# Altium project PCB_Project_MRIamp.PrjPCB (part 2 of 2)

## Sheet monitoring.SchDoc
size A3
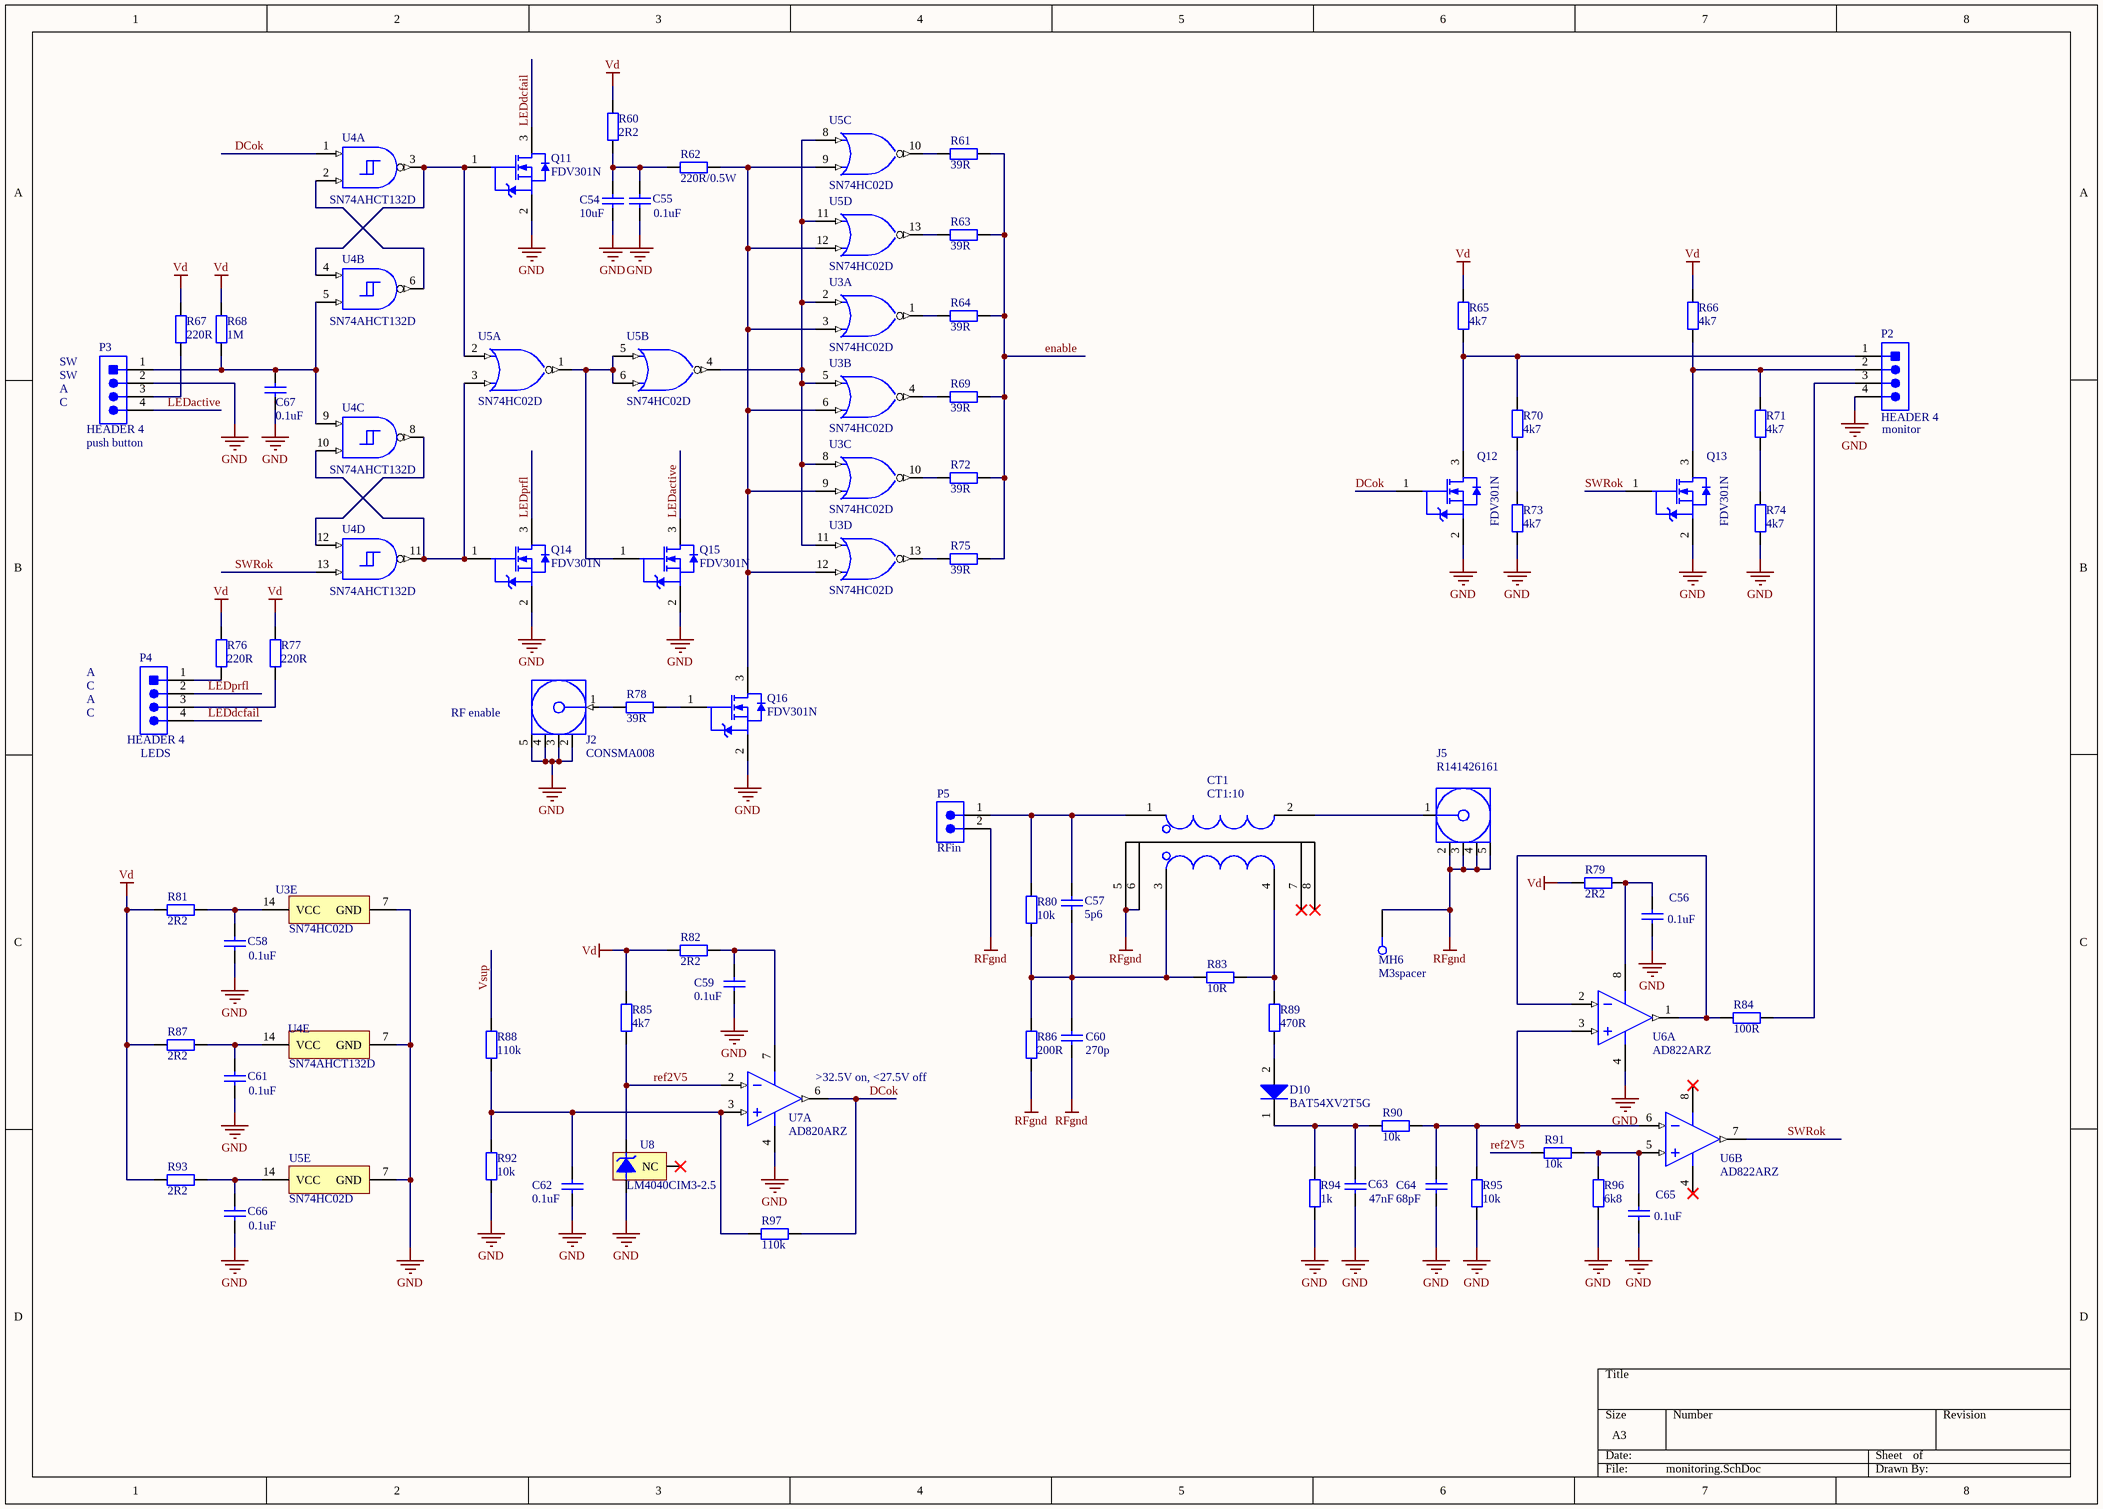
[diagram p1: monitoring.SchDoc]

### Parts
C54  value 10uF  [SM/C_1210]  (hidden comment: Cap)
C55  value 0.1uF  [SM/C_0805]  (hidden comment: Cap)
C56  value 0.1uF  [SM/C_0805]  (hidden comment: Cap)
C57  value 5p6  [SM/C_1206]  (hidden comment: Cap)
C58  value 0.1uF  [SM/C_0805]  (hidden comment: Cap)
C59  value 0.1uF  [SM/C_0805]  (hidden comment: Cap)
C60  value 270p  [SM/C_0805]  (hidden comment: Cap)
C61  value 0.1uF  [SM/C_0805]  (hidden comment: Cap)
C62  value 0.1uF  [SM/C_0805]  (hidden comment: Cap)
C63  value 47nF  [SM/C_0805]  (hidden comment: Cap)
C64  value 68pF  [SM/C_0805]  (hidden comment: Cap)
C65  value 0.1uF  [SM/C_0805]  (hidden comment: Cap)
C66  value 0.1uF  [SM/C_0805]  (hidden comment: Cap)
C67  value 0.1uF  [SM/C_0805]  (hidden comment: Cap)
CT1  CT1:10
D10  BAT54XV2T5G  [ONSC-SOD-523-2-502-01_V]
J2  CONSMA008  [SMA-Grotere-Gaten]
J5  R141426161  [BNC_Danny]
MH6  M3spacer  [MTHOLE3.2MM_TOPBOT7MM]  (no BOM)
P2  HEADER 4  [POLCON.100/VH/TM1SQS/W.300/4]
P3  HEADER 4  [POLCON.100/VH/TM1SQS/W.300/4]
P4  HEADER 4  [POLCON.100/VH/TM1SQS/W.300/4]
P5  RFin  [megaheader]
Q11  FDV301N  [FAIR-SOT23-3_V]
Q12  FDV301N  [FAIR-SOT23-3_V]
Q13  FDV301N  [FAIR-SOT23-3_V]
Q14  FDV301N  [FAIR-SOT23-3_V]
Q15  FDV301N  [FAIR-SOT23-3_V]
Q16  FDV301N  [FAIR-SOT23-3_V]
R60  value 2R2  [SM/R_0805]  (hidden comment: Res2)
R61  value 39R  [SM/R_0805]  (hidden comment: Res2)
R62  value 220R/0.5W  [SM/R_1210]  (hidden comment: Res2)
R63  value 39R  [SM/R_0805]  (hidden comment: Res2)
R64  value 39R  [SM/R_0805]  (hidden comment: Res2)
R65  value 4k7  [SM/R_0805]  (hidden comment: Res2)
R66  value 4k7  [SM/R_0805]  (hidden comment: Res2)
R67  value 220R  [SM/C_1206]  (hidden comment: Res2)
R68  value 1M  [SM/R_0805]  (hidden comment: Res2)
R69  value 39R  [SM/R_0805]  (hidden comment: Res2)
R70  value 4k7  [SM/R_0805]  (hidden comment: Res2)
R71  value 4k7  [SM/R_0805]  (hidden comment: Res2)
R72  value 39R  [SM/R_0805]  (hidden comment: Res2)
R73  value 4k7  [SM/R_0805]  (hidden comment: Res2)
R74  value 4k7  [SM/R_0805]  (hidden comment: Res2)
R75  value 39R  [SM/R_0805]  (hidden comment: Res2)
R76  value 220R  [SM/C_1206]  (hidden comment: Res2)
R77  value 220R  [SM/C_1206]  (hidden comment: Res2)
R78  value 39R  [SM/R_0805]  (hidden comment: Res2)
R79  value 2R2  [SM/R_0805]  (hidden comment: Res2)
R80  value 10k  [AX/.800X.200/.037]  (hidden comment: Res2)
R81  value 2R2  [SM/R_0805]  (hidden comment: Res2)
R82  value 2R2  [SM/R_0805]  (hidden comment: Res2)
R83  value 10R  [AX/.800X.200/.037]  (hidden comment: Res2)
R84  value 100R  [SM/C_1206]  (hidden comment: Res2)
R85  value 4k7  [SM/R_0805]  (hidden comment: Res2)
R86  value 200R  [AX/.550X.150/.034]  (hidden comment: Res2)
R87  value 2R2  [SM/R_0805]  (hidden comment: Res2)
R88  value 110k  [SM/R_0805]  (hidden comment: Res2)
R89  value 470R  [SM/R_0805]  (hidden comment: Res2)
R90  value 10k  [SM/R_0805]  (hidden comment: Res2)
R91  value 10k  [SM/R_0805]  (hidden comment: Res2)
R92  value 10k  [SM/R_0805]  (hidden comment: Res2)
R93  value 2R2  [SM/R_0805]  (hidden comment: Res2)
R94  value 1k  [SM/R_0805]  (hidden comment: Res2)
R95  value 10k  [SM/R_0805]  (hidden comment: Res2)
R96  value 6k8  [SM/R_0805]  (hidden comment: Res2)
R97  value 110k  [SM/R_0805]  (hidden comment: Res2)
U3  SN74HC02D  [D0014A_N]  (parts A,B,C,D,E of 5)
U4  SN74AHCT132D  [D0014A_L]  (parts A,B,C,D,E of 5)
U5  SN74HC02D  [D0014A_N]  (parts A,B,C,D,E of 5)
U6  AD822ARZ  [ADI-R-8_M]  (parts A,B of 2)
U7  AD820ARZ  [ADI-R-8_L]  (part A of 2)
U8  LM4040CIM3-2.5  [DBZ0003A_N]

### Nets
GND: C54.2 C55.1 C56.1 C58.1 C59.1 C61.1 C62.1 C63.1 C64.1 C65.1 C66.1 C67.1 J2.2(GND) J2.3(GND) J2.4(GND) J2.5(GND) P2.4 P3.2 Q11.2(S) Q12.2(S) Q13.2(S) Q14.2(S) Q15.2(S) Q16.2(S) R73.2 R74.2 R92.2 R94.2 R95.1 R96.1 U3.7(GND) U4.7(GND) U5.7(GND) U6.4(-V) U7.4(-VS) U8.2(-V)
RFgnd: C60.1 CT1.5 CT1.6 J5.2 J5.3 J5.4 J5.5 MH6.1(MH) P5.2 R86.2
Vd: R60.1 R65.1 R66.1 R67.1 R68.1 R76.1 R77.1 R79.1 R81.1 R82.1 R85.1 R87.1 R93.1
DCok: Q12.1(G) R97.2 U4.1(1A) U7.6(VOUT)
enable: R61.2 R63.2 R64.2 R69.2 R72.2 R75.2
LEDactive: P3.4 Q15.3(D)
LEDdcfail: P4.4 Q11.3(D)
LEDprfl: P4.2 Q14.3(D)
ref2V5: R85.2 R91.1 U7.2(-IN) U8.1(+V)
SWRok: Q13.1(G) U4.13(4B) U6.7(OUT_2)
Vsup: R88.1
NetC54_1: C54.1 C55.2 R60.2 R62.2
NetC56_2: C56.2 R79.2 U6.8(+V)
NetC57_1: C57.1 C60.2 CT1.3 R80.2 R83.2 R86.1
NetC57_2: C57.2 CT1.1 P5.1 R80.1
NetC58_2: C58.2 R81.2 U3.14(VCC)
NetC59_2: C59.2 R82.2 U7.7(+VS)
NetC61_2: C61.2 R87.2 U4.14(VCC)
NetC62_2: C62.2 R88.2 R92.1 R97.1 U7.3(+IN)
NetC63_2: C63.2 D10.1(K) R90.1 R94.1
NetC64_2: C64.2 R90.2 R95.2 U6.3(+IN_1) U6.6(-IN_2)
NetC65_2: C65.2 R91.2 R96.2 U6.5(+IN_2)
NetC66_2: C66.2 R93.2 U5.14(VCC)
NetC67_2: C67.2 P3.1 R68.2 U4.5(2B) U4.9(3A)
NetCT1_2: CT1.2 J5.1
NetCT1_4: CT1.4 R83.1 R89.1
NetD10_2: D10.2(A) R89.2
NetJ2_1: J2.1(Signal) R78.1
NetP2_1: P2.1 Q12.3(D) R65.2 R70.1
NetP2_2: P2.2 Q13.3(D) R66.2 R71.1
NetP2_3: P2.3 R84.1
NetP3_3: P3.3 R67.2
NetP4_1: P4.1 R76.2
NetP4_3: P4.3 R77.2
NetQ11_1: Q11.1(G) U4.3(1Y) U4.4(2A) U5.2(1A)
NetQ14_1: Q14.1(G) U4.10(3B) U4.11(4Y) U5.3(1B)
NetQ15_1: Q15.1(G) U5.1(1Y) U5.5(2A) U5.6(2B)
NetQ16_1: Q16.1(G) R78.2
NetQ16_3: Q16.3(D) R62.1 U3.3(1B) U3.6(2B) U3.9(3B) U3.12(4B) U5.9(3B) U5.12(4B)
NetR61_1: R61.1 U5.10(3Y)
NetR63_1: R63.1 U5.13(4Y)
NetR64_1: R64.1 U3.1(1Y)
NetR69_1: R69.1 U3.4(2Y)
NetR70_2: R70.2 R73.1
NetR71_2: R71.2 R74.1
NetR72_1: R72.1 U3.10(3Y)
NetR75_1: R75.1 U3.13(4Y)
NetR84_2: R84.2 U6.1(OUT_1) U6.2(-IN_1)
NetU3_2: U3.2(1A) U3.5(2A) U3.8(3A) U3.11(4A) U5.4(2Y) U5.8(3A) U5.11(4A)
NetU4_2: U4.2(1B) U4.6(2Y)
NetU4_8: U4.8(3Y) U4.12(4A)

Not connected (* = marked no-connect by the designer): CT1 7* 8*; U8 3(NC)*

### Notes on the sheet
- SW
- A
- C
- (near P3) push button
- (near P2) monitor
- (near J2) RF enable
- (near P4) LEDS
- (near U7) >32.5V on, <27.5V off

### Library data of the parts
C54 = Cap: Capacitor; FA: 1828840; Published: 8-Jun-2000; LatestRevisionDate: 17-Jul-2002; LatestRevisionNote: Re-released for DXP Platform.; PackageReference: RAD-0.3; Publisher: Altium Limited; PackageDescription: Radial Cap, Thru-Hole; 2 Leads; 0.3 in Pin Spacing
C55 C56 C58 C59 C61 C62 C65-C67 = Cap: Capacitor; FA: 2470440; Published: 8-Jun-2000; LatestRevisionDate: 17-Jul-2002; LatestRevisionNote: Re-released for DXP Platform.; PackageReference: RAD-0.3; Publisher: Altium Limited; PackageDescription: Radial Cap, Thru-Hole; 2 Leads; 0.3 in Pin Spacing
C57 = Cap: Capacitor; FA: 1301968; Published: 8-Jun-2000; LatestRevisionDate: 17-Jul-2002; LatestRevisionNote: Re-released for DXP Platform.; PackageReference: RAD-0.3; Publisher: Altium Limited; PackageDescription: Radial Cap, Thru-Hole; 2 Leads; 0.3 in Pin Spacing
C60 = Cap: Capacitor; FA: 2332698; Published: 8-Jun-2000; LatestRevisionDate: 17-Jul-2002; LatestRevisionNote: Re-released for DXP Platform.; PackageReference: RAD-0.3; Publisher: Altium Limited; PackageDescription: Radial Cap, Thru-Hole; 2 Leads; 0.3 in Pin Spacing
C63 = Cap: Capacitor; Published: 8-Jun-2000; LatestRevisionDate: 17-Jul-2002; LatestRevisionNote: Re-released for DXP Platform.; PackageReference: RAD-0.3; Publisher: Altium Limited; PackageDescription: Radial Cap, Thru-Hole; 2 Leads; 0.3 in Pin Spacing
C64 = Cap: Capacitor; FA: 1759274; Published: 8-Jun-2000; LatestRevisionDate: 17-Jul-2002; LatestRevisionNote: Re-released for DXP Platform.; PackageReference: RAD-0.3; Publisher: Altium Limited; PackageDescription: Radial Cap, Thru-Hole; 2 Leads; 0.3 in Pin Spacing
CT1 = Component_1
D10 = CMP-1055-00490-1: Schottky Barrier Diode, 2-Pin SOD-523, Pb-Free, Tape and Reel; Manufacturer: On Semiconductor; IFSM Max (A): 0.6; trr Max (ns): 5; Configuration: Single; FA: 2322476; PackageDescription: 2-Pin SOD, Body 1.2 x 0.8 mm; PackageReference: SOD-523-2-502-01; DatasheetVersion: Rev. 8; Packing: Tape and Reel; PackageVersion: Rev. E, 09/2010; ComponentLink2Description: Datasheet; ComponentLink3URL: http://www.onsemi.com/pub_link/Collateral/502-01.PDF; PartNumber: BAT54XV2T5G; RoHS: TRUE; ComponentLink2URL: http://www.onsemi.cn/pub_link/Collateral/BAT54XV2T1-D.PDF; ComponentLink1Description: Manufacturer URL; Mounting Technology: Surface Mount; ComponentLink3Description: Package Specification; ComponentLink1URL: http://www.onsemi.com/
J2 = CMP-0168-00003-1: SMA Female PCB Mount Connector - Extended; FA: 2112465; PackageDescription: SMA Female PCB Mount Connector, Extended, Thru-Hole, 7 x 7 mm Body; PackageReference: CON-SMA-L; DatasheetVersion: revB, Feb-2010; PackageVersion: revB, Feb-2010
J5 = CMP-2000-05627-1: Jack BNC Connector, 1 Position, Height 16.26 mm, Tail Length 6.35 mm, -55 to 85 degC, RoHS, Tube; Manufacturer: TE Connectivity; Frequency - Max: 4GHz; Dynamic Catalog: BNCConnectors; Connector Type: Jack,FemaleSockets; Other Names: A32269; Impedance: 50Ohm; 3D Model: 5227699-2.pdf; Contact Termination: Solder; FA: 4195115; Standard Package: 30; Mounting Technology: ThroughHole; Package Reference: 5227699-2; Category: Connectors,Interconnects; Datasheet URL: http://www.te.com/commerce/DocumentDelivery/DDEController?Action=showdoc&DocId=Customer+Drawing%7F5227699%7FA1%7Fpdf%7FEnglish%7FENG_CD_5227699_A1.pdf%7F5227699-2; Mounting Type: ThroughHole,Flange(Square); Datasheet Version: Rev. A1, 03/2011; Manufacturer URL: http://www.te.com/; RoHS Information: 5227699-2StatementofCompliance; Fastening Type: BayonetLock; Series: BNC; Connector Style: BNC; Family: CoaxialConnectors(RF); Packaging: Bulk; Package Description: Jack BNC Connector, 1 Position, Height 16.26 mm, Tail Length 6.35 mm
MH6 = CMP-0001-00114-1: Mounting Hole, Embedded System Module, 3.2mm pad, 2.7mm plated hole, Top / Bottom copper regions; ClassName: Mounting Hole; Publisher: Altium; Package Reference: Mounting-Hole-ESM
P2-P4 = CMP-1755-00007-1: Male Header, Pitch 2.5 mm, 1 x 4 Position, Height 6.1 mm, Tail Length 3.4 mm, -25 to 85 degC, RoHS, Bulk; FA: 588593; PackageReference: S4B-XH-A(LF)(SN); ComponentLink1Description: Manufacturer URL; DatasheetVersion: May-16; ComponentLink2Description: Datasheet; ComponentLink2URL: http://www.jst-mfg.com/product/pdf/eng/eXH.pdf; ComponentLink1URL: http://www.jst.com/home2.html; PackageDescription: Male Header, Pitch 2.5 mm, 1 x 4 Position, Height 6.1 mm, Tail Length 3.4 mm
P5 = CMP-0815-00001-1: Pin Header, Pitch 2.54 mm, 1 x 2 Positions, Straight, Mated Height 6.5 mm, Surface Mount, -40 to 105 degC, RoHS, Tape and Reel; Manufacturer: GCT; PartNumber: BG055-02-A-1-0650-0530-0350-L-B; Dielectric Withstanding: 600 V AC; Insulation Resistance: 1000 MOhm Min.; Current Rating: 3 A; Contact Resistance: 20 mOhm Max.; PackageReference: BG055-02-A-1-0650-0530-0350-2; PackageDescription: Pin Header, Pitch 2.54 mm, 1 x 2 Positions, Mated Height 6.5 mm; ComponentLink2URL: http://www.gct.co/pcb-board-to-board/pdf/BG055.pdf; Operating Temperature: -40 to 105 degC; ComponentLink2Description: Datasheet; RoHS: TRUE; ComponentLink1URL: http://www.gct.co/; Mounting Technology: Surface Mount; Orientation: Straight; ComponentLink1Description: Manufacturer URL; Packing: Tape and Reel; DatasheetVersion: Rev. G
Q11-Q16 = CMP-2000-04935-1: Digital FET, N-Channel, 0.35 W, 25 V, -55 to 150 degC, 3-Pin SOT23, RoHS, Tape and Reel; Manufacturer: Fairchild; Rds(on) Test Voltage Vgs: 2.7V; Threshold Voltage Vgs Typ: 850mV; Voltage Vds Typ: 25V; Transistor Case Style: SOT-23; Reel Quantity: 3000; Voltage Vgs Rds on Measurement: 4.5V; Power Dissipation Pd: 350mW; Continuous Drain Current Id: 220mA; Transistor Polarity: NChannel; No. of Transistors: 1; Package Version: Rev. 12, 03/2016; Voltage Vgs th Max: 1.5V; ESD HBM: 6kV; Pulse Current Idm: 500mA; Current Temperature: 25degC; On Resistance Rds(on): 5ohm; External Depth: 2.5mm; SMD Marking: 301; No. of Pins: 3; External Width: 3.05mm; SVHC: NoSVHC(19-Dec-2012); External Length / Height: 1.12mm; FA: 9845011; Termination Type: SMD; Package Reference: SOT23-3; Package URL: http://www.fairchildsemi.com/dwg/MA/MA03D.pdf; Voltage Vgs Max: 850mV; Drain Source Voltage Vds: 25V; Operating Temperature Max: 150degC; Package Description: 3-Pin Small Outline Transistor, Body 2.92 x 1.325 mm, Pitch 0.95 mm; Operating Temperature Min: -55degC; Datasheet Version: Jun-09; Tape Width: 8mm; Full Power Rating Temperature: 25degC; Datasheet URL: https://datasheet.ciiva.com/8114/fdv301n-8114688.pdf; Package / Case: SOT-23; Manufacturer URL: https://www.fairchildsemi.com/; Current Id Max: 220mA; Operating Temperature Range: -55degCto+150degC
R60 R79 R81 R82 R87 R93 = Res2: Resistor; FA: 2074326; Published: 8-Jun-2000; LatestRevisionDate: 17-Jul-2002; LatestRevisionNote: Re-released for DXP Platform.; PackageReference: AXIAL-0.4; Publisher: Altium Limited; PackageDescription: Axial Device, Thru-Hole; 2 Leads; 0.4 in Pin Spacing
R61 R63 R64 R69 R72 R75 R78 = Res2: Resistor; FA: 2074459; Published: 8-Jun-2000; LatestRevisionDate: 17-Jul-2002; LatestRevisionNote: Re-released for DXP Platform.; PackageReference: AXIAL-0.4; Publisher: Altium Limited; PackageDescription: Axial Device, Thru-Hole; 2 Leads; 0.4 in Pin Spacing
R62 = Res2: Resistor; FA: 2324036; Published: 8-Jun-2000; LatestRevisionDate: 17-Jul-2002; LatestRevisionNote: Re-released for DXP Platform.; PackageReference: AXIAL-0.4; Publisher: Altium Limited; PackageDescription: Axial Device, Thru-Hole; 2 Leads; 0.4 in Pin Spacing
R65 R66 R70 R71 R73 R74 R85 = Res2: Resistor; FA: 2447672; Published: 8-Jun-2000; LatestRevisionDate: 17-Jul-2002; LatestRevisionNote: Re-released for DXP Platform.; PackageReference: AXIAL-0.4; Publisher: Altium Limited; PackageDescription: Axial Device, Thru-Hole; 2 Leads; 0.4 in Pin Spacing
R67 R76 R77 = Res2: Resistor; FA: 2447486; Published: 8-Jun-2000; LatestRevisionDate: 17-Jul-2002; LatestRevisionNote: Re-released for DXP Platform.; PackageReference: AXIAL-0.4; Publisher: Altium Limited; PackageDescription: Axial Device, Thru-Hole; 2 Leads; 0.4 in Pin Spacing
R68 = Res2: Resistor; FA: 2447596; Published: 8-Jun-2000; LatestRevisionDate: 17-Jul-2002; LatestRevisionNote: Re-released for DXP Platform.; PackageReference: AXIAL-0.4; Publisher: Altium Limited; PackageDescription: Axial Device, Thru-Hole; 2 Leads; 0.4 in Pin Spacing
R80 = Res2: Resistor; FA: 1738702; Published: 8-Jun-2000; LatestRevisionDate: 17-Jul-2002; LatestRevisionNote: Re-released for DXP Platform.; PackageReference: AXIAL-0.4; Publisher: Altium Limited; PackageDescription: Axial Device, Thru-Hole; 2 Leads; 0.4 in Pin Spacing
R83 = Res2: Resistor; FA: 1357898; Published: 8-Jun-2000; LatestRevisionDate: 17-Jul-2002; LatestRevisionNote: Re-released for DXP Platform.; PackageReference: AXIAL-0.4; Publisher: Altium Limited; PackageDescription: Axial Device, Thru-Hole; 2 Leads; 0.4 in Pin Spacing
R84 = Res2: Resistor; FA: 2447454; Published: 8-Jun-2000; LatestRevisionDate: 17-Jul-2002; LatestRevisionNote: Re-released for DXP Platform.; PackageReference: AXIAL-0.4; Publisher: Altium Limited; PackageDescription: Axial Device, Thru-Hole; 2 Leads; 0.4 in Pin Spacing
R86 = Res2: Resistor; FA: 9340149; Published: 8-Jun-2000; LatestRevisionDate: 17-Jul-2002; LatestRevisionNote: Re-released for DXP Platform.; PackageReference: AXIAL-0.4; Publisher: Altium Limited; PackageDescription: Axial Device, Thru-Hole; 2 Leads; 0.4 in Pin Spacing
R88 R97 = Res2: Resistor; FA: 2447557; Published: 8-Jun-2000; LatestRevisionDate: 17-Jul-2002; LatestRevisionNote: Re-released for DXP Platform.; PackageReference: AXIAL-0.4; Publisher: Altium Limited; PackageDescription: Axial Device, Thru-Hole; 2 Leads; 0.4 in Pin Spacing
R89 = Res2: Resistor; FA: 2447662; Published: 8-Jun-2000; LatestRevisionDate: 17-Jul-2002; LatestRevisionNote: Re-released for DXP Platform.; PackageReference: AXIAL-0.4; Publisher: Altium Limited; PackageDescription: Axial Device, Thru-Hole; 2 Leads; 0.4 in Pin Spacing
R90-R92 R95 = Res2: Resistor; FA: 2447553; Published: 8-Jun-2000; LatestRevisionDate: 17-Jul-2002; LatestRevisionNote: Re-released for DXP Platform.; PackageReference: AXIAL-0.4; Publisher: Altium Limited; PackageDescription: Axial Device, Thru-Hole; 2 Leads; 0.4 in Pin Spacing
R94 = Res2: Resistor; Published: 8-Jun-2000; LatestRevisionDate: 17-Jul-2002; LatestRevisionNote: Re-released for DXP Platform.; PackageReference: AXIAL-0.4; Publisher: Altium Limited; PackageDescription: Axial Device, Thru-Hole; 2 Leads; 0.4 in Pin Spacing
R96 = Res2: Resistor; FA: 2447711; Published: 8-Jun-2000; LatestRevisionDate: 17-Jul-2002; LatestRevisionNote: Re-released for DXP Platform.; PackageReference: AXIAL-0.4; Publisher: Altium Limited; PackageDescription: Axial Device, Thru-Hole; 2 Leads; 0.4 in Pin Spacing
U3 U5 = CMP-0806-00060-3: Quadruple 2-Input Positive-NOR Gates, D0014A, TUBE; Manufacturer: Texas Instruments; Output Type: CMOS; Output Drive (IOL/IOH)(Max)(mA): 4/-4; ICC @ Nom Voltage(Max)(mA): 0.02; tpd @ Nom Voltage(Max)(ns): 23; Bits(#): 4; VCC(Min)(V): 2; Voltage(Nom)(V): 5; VCC(Max)(V): 6; F @ Nom Voltage(Max)(Mhz): 70; Rating: Catalog; FA: 9590900; Code_JEDEC: MS-012; Generic Part Number: SN74HC02; Input Type: CMOS; PackageReference: D0014A; PackageVersion: http://www.ti.com/lit/ml/mpds177g/mpds177g.pdf; Operating Temperature Range(C): -40 to 85; DatasheetVersion: SCLS076E
U4 = CMP-1627-00035-3: Quadruple Positive-NAND Gates With Schmitt-Trigger Inputs, D0014A, TUBE; Manufacturer: Texas Instruments; Output Drive (IOL/IOH)(Max)(mA): 8/-8; Rating: Catalog; tpd @ Nom Voltage(Max)(ns): 10; VCC(Min)(V): 4.5; ICC @ Nom Voltage(Max)(mA): 0.02; VCC(Max)(V): 5.5; Bits(#): 4; Input Type: TTL; Schmitt Trigger: Yes; Technology Family: AHCT; Voltage(Nom)(V): 5; Output Type: CMOS; F @ Nom Voltage(Max)(Mhz): 70; FA: 1739982; Generic Part Number: SN74AHCT132; Code_JEDEC: MS-012; Operating Temperature Range(C): -40 to 85; DatasheetVersion: SCLS366G; PackageReference: D0014A
U6 = CMP-0384-00785-2: Double Channel Rail-to-Rail Operational Amplifier, 1.9 MHz BW, 3 V/us SR, Industrial, 8-pin SOIC (R-8), Tube; Manufacturer: Analog Devices; Generic Part Number: AD822; Iq/Amp: 900uA; V Span Max: 30V; Input Offset Voltage: 100uV; Amplifiers Per Package: 2; Input Bias Current: 2pA; V Span Min: 5V; Small Signal Bandwidth: 1.9MHz; Slew Rate: 3V/us; FA: 9994351; ComponentLink1Description: Manufacturer URL; PackageDescription: 8-Pin Standard Small Outline Package, Body 3.9 x 4.9 mm, Pitch 1.27 mm; PackageReference: R-8; DatasheetVersion: Rev. I; PartNumber: AD822ARZ; RevisionNote: Reference Circuit URL fixed; PackageVersion: 060506-A; Code_JEDEC: MS-012-AA; ComponentLink4Description: Reference Circuit; ComponentLink2Description: Datasheet; Mounting Technology: Surface Mount; ComponentLink4URL: http://www.analog.com/en/all-operational-amplifiers-op-amps/operational-amplifiers-op-amps/ad822/products/product.html#product-recommendations; ComponentLink1URL: http://www.analog.com/en/index.html; ComponentLink2URL: http://www.analog.com/static/imported-files/data_sheets/AD822.pdf; ComponentLink3Description: Package Specification; ComponentLink3URL: http://www.analog.com/static/imported-files/packages/PKG_PDF/SOIC_Narrow%20(R)/R_8.pdf
U7 = CMP-0384-00651-1: Single Channel Rail-to-Rail Operational Amplifier, 1.9 MHz BW, 3 V/us SR, Industrial, 8-pin SOIC (R-8), Reel; PartNumber: AD820ARZ-REEL7; Generic Part Number: AD820; Manufacturer: Analog Devices; Input Bias Current: 2pA; Amplifiers Per Package: 1; V Span Min: 5V; Iq/Amp: 900uA; Input Offset Voltage: 100uV; V Span Max: 36V; Small Signal Bandwidth: 1.9MHz; Slew Rate: 3V/us; FA: 9426469; ComponentLink2Description: Datasheet; Mounting Technology: Surface Mount; ComponentLink1Description: Manufacturer URL; ComponentLink2URL: http://www.analog.com/static/imported-files/data_sheets/AD820.pdf; DatasheetVersion: Rev. H; ComponentLink1URL: http://www.analog.com/en/index.html; Code_JEDEC: MS-012-AA; ComponentLink3URL: http://www.analog.com/static/imported-files/packages/PKG_PDF/SOIC_Narrow%20(R)/R_8.pdf; ComponentLink3Description: Package Specification; PackageReference: R-8; PackageDescription: 8-Pin Standard Small Outline Package, Body 3.9 x 4.9 mm, Pitch 1.27 mm; PackageVersion: 060506-A
U8 = CMP-0074-00570-3: Precision Micropower Shunt Voltage Reference, 3-pin SOT-23; Manufacturer: Texas Instruments; PackageTopMarking: R2C*XTT; CompType: Voltage Reference IC; PowerWise: N; FA: 1468840; RevisionNote: Component URLs added; PinCount: 3; PackageDescription: Molded SOT-23, .115 x .051 x .037in Body, 3 Lead, .075 in Pitch; ComponentLink1URL: http://www.ti.com/general/docs/lit/getliterature.tsp?genericPartNumber=LM4040-N&fileType=pdf; DatasheetVersion: Apr-2005; PackageReference: DBZ0003A; PackageVersion: revB, Mar-2003; ComponentLink1Description: Datasheet URL; RoHS: N

## Nets that join several sheets
GND: MRIAMP (53 pins), monitoring (36 pins)
Vd: MRIAMP (C51.1 C52.1 C53.1 FB3.2), monitoring (13 pins)
enable: MRIAMP (Q4.3 R25.2 U2.8), monitoring (6 pins)
Vsup: MRIAMP (22 pins), monitoring (R88.1)